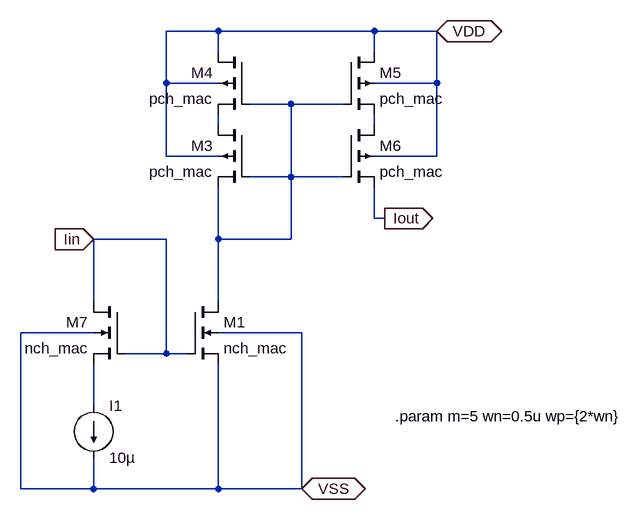
[diagram p0: schematic CurrentMirror.asc]
CurrentMirror.asc, the LTspice schematic file:
Version 4
SHEET 1 952 680
WIRE 256 -256 176 -256
WIRE 496 -256 256 -256
WIRE 592 -256 496 -256
WIRE 256 -224 256 -256
WIRE 496 -224 496 -256
WIRE 176 -176 176 -256
WIRE 256 -176 176 -176
WIRE 592 -176 592 -256
WIRE 592 -176 496 -176
WIRE 368 -144 304 -144
WIRE 448 -144 368 -144
WIRE 256 -112 256 -128
WIRE 496 -112 496 -128
WIRE 176 -64 176 -176
WIRE 256 -64 176 -64
WIRE 592 -64 592 -176
WIRE 592 -64 496 -64
WIRE 368 -32 368 -144
WIRE 368 -32 304 -32
WIRE 448 -32 368 -32
WIRE 496 32 496 -16
WIRE 512 32 496 32
WIRE 176 64 64 64
WIRE 256 64 256 -16
WIRE 368 64 368 -32
WIRE 368 64 256 64
WIRE 64 160 64 64
WIRE 256 160 256 64
WIRE 64 208 -48 208
WIRE 384 208 256 208
WIRE 176 240 176 64
WIRE 176 240 112 240
WIRE 208 240 176 240
WIRE 64 320 64 256
WIRE -48 448 -48 208
WIRE 64 448 64 400
WIRE 64 448 -48 448
WIRE 256 448 256 256
WIRE 256 448 64 448
WIRE 384 448 384 208
WIRE 384 448 256 448
FLAG 592 -256 VDD
IOPIN 592 -256 BiDir
FLAG 384 448 VSS
IOPIN 384 448 BiDir
FLAG 64 64 Iin
IOPIN 64 64 In
FLAG 512 32 Iout
IOPIN 512 32 Out
SYMBOL nmos4 208 160 R0
SYMATTR InstName M1
SYMATTR Value nch_mac
SYMATTR Value2 l=180n w={wn} m={m}
SYMBOL pmos4 304 -112 M0
SYMATTR InstName M3
SYMATTR Value pch_mac
SYMATTR Value2 l=180n w={wp} m={m}
SYMBOL pmos4 304 -224 M0
SYMATTR InstName M4
SYMATTR Value pch_mac
SYMATTR Value2 l=180n w={wp} m={m}
SYMBOL pmos4 448 -224 R0
SYMATTR InstName M5
SYMATTR Value pch_mac
SYMATTR Value2 l=180n w={wp} m={m}
SYMBOL pmos4 448 -112 R0
SYMATTR InstName M6
SYMATTR Value pch_mac
SYMATTR Value2 l=180n w={wp} m={m}
SYMBOL nmos4 112 160 M0
SYMATTR InstName M7
SYMATTR Value nch_mac
SYMATTR Value2 l=180n w={wn} m={m}
SYMBOL current 64 320 R0
WINDOW 123 0 0 Left 0
WINDOW 39 0 0 Left 0
SYMATTR InstName I1
SYMATTR Value 10µ
TEXT 528 336 Left 2 !.param m=5 wn=0.5u wp={2*wn}

The netlist it stands for:
* CurrentMirror.asc
M1 N001 Iin VSS VSS nch_mac l=180n w={wn} m={m}
M3 N002 N001 N001 VDD pch_mac l=180n w={wp} m={m}
M4 VDD N001 N002 VDD pch_mac l=180n w={wp} m={m}
M5 VDD N001 N003 VDD pch_mac l=180n w={wp} m={m}
M6 N003 N001 Iout VDD pch_mac l=180n w={wp} m={m}
M7 Iin Iin N004 VSS nch_mac l=180n w={wn} m={m}
I1 N004 VSS 10µ
.model NMOS NMOS
.model PMOS PMOS
.lib standard.mos
.param m=5 wn=0.5u wp={2*wn}
.backanno
.end